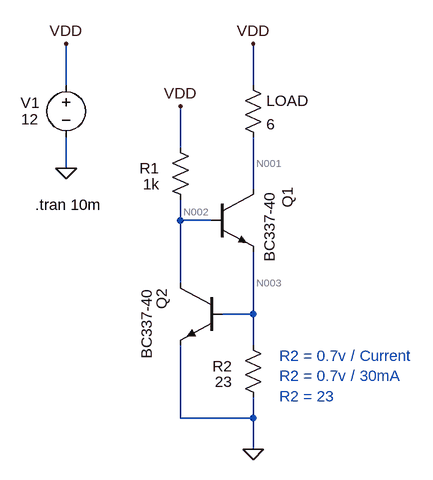
[diagram p0: schematic v1.0.asc]
v1.0.asc, the LTspice schematic file:
Version 4.1
SHEET 1 880 708
WIRE 192 -112 192 -176
WIRE 480 -112 480 -176
WIRE 368 -16 368 -80
WIRE 192 16 192 -32
WIRE 480 48 480 -32
WIRE 368 96 368 64
WIRE 416 96 368 96
WIRE 368 192 368 96
WIRE 480 240 480 144
WIRE 480 240 432 240
WIRE 480 288 480 240
WIRE 368 400 368 288
WIRE 480 400 480 368
WIRE 480 400 368 400
WIRE 480 448 480 400
FLAG 192 16 0
FLAG 480 448 0
FLAG 192 -176 VDD
FLAG 480 -176 VDD
FLAG 368 -80 VDD
SYMBOL voltage 192 -128 R0
WINDOW 0 -70 43 Left 2
WINDOW 3 -69 68 Left 2
WINDOW 123 0 0 Left 0
WINDOW 39 0 0 Left 0
SYMATTR InstName V1
SYMATTR Value 12
SYMBOL res 384 80 R180
WINDOW 0 48 64 Left 2
WINDOW 3 48 40 Left 2
SYMATTR InstName R1
SYMATTR Value 1k
SYMBOL npn 432 192 M0
WINDOW 0 93 9 VRight 2
WINDOW 3 116 8 VRight 2
SYMATTR InstName Q2
SYMATTR Value BC337-40
SYMBOL res 496 384 R180
WINDOW 0 48 64 Left 2
WINDOW 3 48 40 Left 2
SYMATTR InstName R2
SYMATTR Value 23
SYMBOL res 464 -128 R0
SYMATTR InstName LOAD
SYMATTR Value 6
SYMBOL npn 416 48 R0
WINDOW 0 117 -3 VRight 2
WINDOW 3 89 112 VLeft 2
SYMATTR InstName Q1
SYMATTR Value BC337-40
TEXT 144 72 Left 2 !.tran 10m
TEXT 520 304 Left 2 ;R2 = 0.7v / Current\nR2 = 0.7v / 30mA\nR2 = 23

The netlist it stands for:
* v1.0.asc
V1 VDD 0 12
R1 N002 VDD 1k
Q2 N002 N003 0 0 BC337-40
R2 0 N003 23
R§LOAD VDD N001 6
Q1 N001 N002 N003 0 BC337-40
.model NPN NPN
.model PNP PNP
.lib standard.bjt
.tran 10m
* R2 = 0.7v / Current
* R2 = 0.7v / 30mA
* R2 = 23
.backanno
.end

* Results of the author's LTspice run, read from the files saved beside the schematic
* Operating Point, zero values left out:
*   V(n001) = 11.83 V
*   V(n002) = 1.351 V
*   V(n003) = 661.6 mV
*   V(vdd) = 12 V
*   I(LOAD) = 28.73 mA
*   I(R1) = -10.65 mA
*   I(R2) = -28.77 mA
*   I(V1) = -39.38 mA
*   Ib(Q1) = 64.94 µA
*   Ib(Q2) = 25.76 µA
*   Ic(Q1) = 28.73 mA
*   Ic(Q2) = 10.58 mA
*   Ie(Q1) = -28.79 mA
*   Ie(Q2) = -10.61 mA
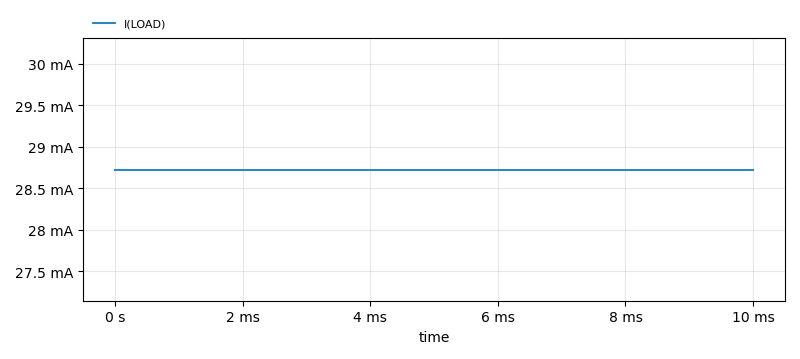
[diagram p1: Transient Analysis of v1.0.asc, plotted from the saved traces]
* Transient Analysis, 1 run:
*   I(LOAD): min 28.73 mA, max 28.73 mA, average 28.73 mA, rms 28.73 mA, last 28.73 mA